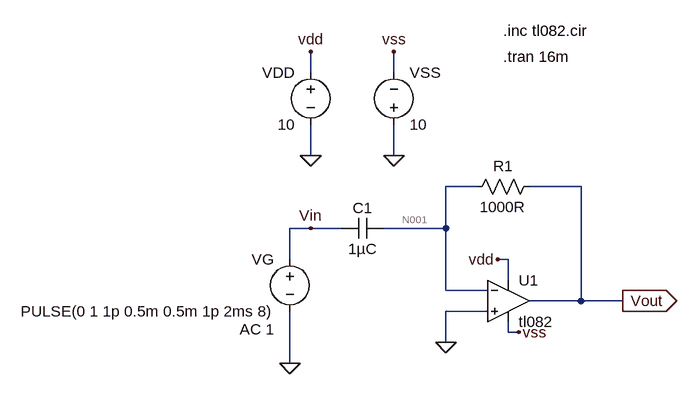
[diagram p0: schematic Response_triangular_Differentiator.asc]
Response_triangular_Differentiator.asc, the LTspice schematic file:
Version 4
SHEET 1 948 680
WIRE -64 -176 -64 -208
WIRE 64 -176 64 -208
WIRE -64 -48 -64 -96
WIRE 64 -48 64 -96
WIRE 192 0 144 0
WIRE 352 0 272 0
WIRE -64 64 -96 64
WIRE -16 64 -64 64
WIRE 144 64 144 0
WIRE 144 64 48 64
WIRE -96 112 -96 64
WIRE 240 112 224 112
WIRE 240 144 240 112
WIRE 144 160 144 64
WIRE 208 160 144 160
WIRE 352 176 352 0
WIRE 352 176 272 176
WIRE 416 176 352 176
WIRE 208 192 144 192
WIRE 240 224 240 208
WIRE 256 224 240 224
WIRE 144 240 144 192
WIRE -96 272 -96 192
FLAG -64 -48 0
FLAG 64 -48 0
FLAG -64 -208 vdd
FLAG 224 112 vdd
FLAG 64 -208 vss
FLAG 256 224 vss
FLAG 144 240 0
FLAG -96 272 0
FLAG 416 176 Vout
IOPIN 416 176 Out
FLAG -64 64 Vin
SYMBOL voltage -96 96 M0
WINDOW 123 24 124 Left 2
WINDOW 39 0 0 Left 2
SYMATTR Value2 AC 1
SYMATTR InstName VG
SYMATTR Value PULSE(0 1 1p 0.5m 0.5m 1p 2ms 8)
SYMBOL voltage -64 -192 M0
SYMATTR InstName VDD
SYMATTR Value 10
SYMBOL voltage 64 -80 M180
WINDOW 0 24 96 Left 2
WINDOW 3 24 16 Left 2
SYMATTR InstName VSS
SYMATTR Value 10
SYMBOL Opamps\\opamp2 240 112 R0
SYMATTR InstName U1
SYMATTR Value tl082
SYMBOL cap 48 48 R90
WINDOW 0 0 32 VBottom 2
WINDOW 3 32 32 VTop 2
SYMATTR InstName C1
SYMATTR Value 1µC
SYMBOL res 288 -16 R90
WINDOW 0 0 56 VBottom 2
WINDOW 3 32 56 VTop 2
SYMATTR InstName R1
SYMATTR Value 1000R
TEXT 232 -240 Left 2 !.inc tl082.cir
TEXT 232 -200 Left 2 !.tran 16m

The netlist it stands for:
* Response_triangular_Differentiator.asc
VG Vin 0 PULSE(0 1 1p 0.5m 0.5m 1p 2ms 8) AC 1
VDD vdd 0 10
VSS 0 vss 10
XU1 0 N001 vdd vss Vout tl082  ; pins In+ In- V+ V- OUT
C1 N001 Vin 1µC
R1 Vout N001 1000R
.inc tl082.cir
.tran 16m
.backanno
.end

* Results of the author's LTspice run, read from the files saved beside the schematic
* Operating Point, zero values left out:
*   V(vdd) = 10 V
*   V(vss) = -10 V
*   V(vout) = 11.01 µV
*   V(n001) = 10.97 µV
*   I(R1) = 40.05 pA
*   I(Vss) = -9.528 mA
*   I(Vdd) = -9.528 mA
*   Ix(u1:1) = 40.05 pA
*   Ix(u1:2) = 40.05 pA
*   Ix(u1:3) = 9.528 mA
*   Ix(u1:4) = -9.528 mA
*   Ix(u1:5) = -40.05 pA
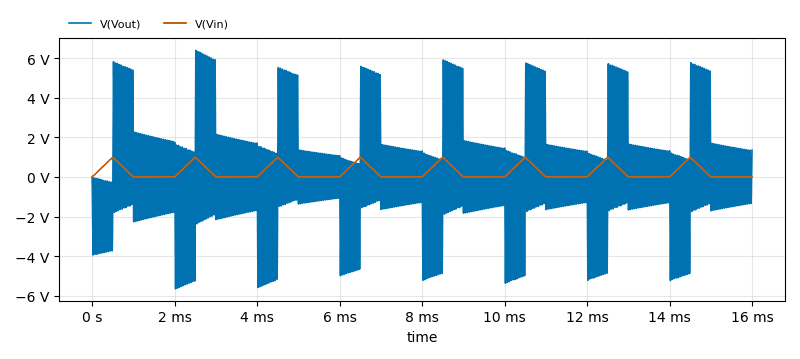
[diagram p1: Transient Analysis of Response_triangular_Differentiator.asc, plotted from the saved traces]
* Transient Analysis, 1 run:
*   V(Vout): min -5.65 V, max 6.395 V, average -81.58 µV, rms 2.334 V, last 1.353 V
*   V(Vin): min 0 V, max 1 V, average 250 mV, rms 408.3 mV, last 0 V